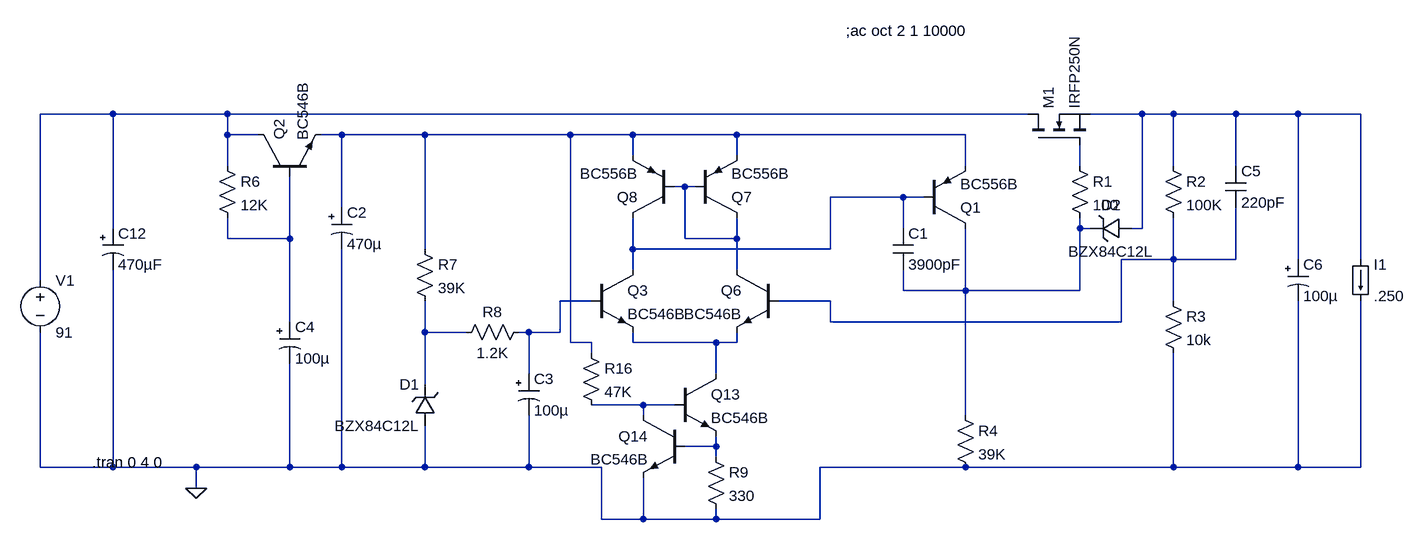
[diagram p0: schematic Sigma11.asc]
Sigma11.asc, the LTspice schematic file:
Version 4
SHEET 1 1752 1332
WIRE -272 112 -384 112
WIRE -96 112 -272 112
WIRE 1136 112 -96 112
WIRE 1312 112 1232 112
WIRE 1360 112 1312 112
WIRE 1456 112 1360 112
WIRE 1552 112 1456 112
WIRE 1648 112 1552 112
WIRE -96 144 -96 112
WIRE -48 144 -96 144
WIRE 80 144 48 144
WIRE 208 144 80 144
WIRE 432 144 208 144
WIRE 528 144 432 144
WIRE 688 144 528 144
WIRE 1040 144 688 144
WIRE 528 176 528 144
WIRE 688 176 688 144
WIRE -96 192 -96 144
WIRE 1040 192 1040 144
WIRE 1216 192 1216 160
WIRE 1360 192 1360 112
WIRE 1456 192 1456 112
WIRE 608 224 592 224
WIRE 624 224 608 224
WIRE 944 240 832 240
WIRE 976 240 944 240
WIRE 80 256 80 144
WIRE -272 288 -272 112
WIRE 944 288 944 240
WIRE 1216 288 1216 272
WIRE 1232 288 1216 288
WIRE 1312 288 1312 112
WIRE 1312 288 1296 288
WIRE -96 304 -96 272
WIRE 0 304 0 208
WIRE 0 304 -96 304
WIRE 608 304 608 224
WIRE 688 304 688 272
WIRE 688 304 608 304
WIRE 208 320 208 144
WIRE 528 320 528 272
WIRE 832 320 832 240
WIRE 832 320 528 320
WIRE 1360 336 1360 272
WIRE 1360 336 1280 336
WIRE 1456 336 1456 256
WIRE 1456 336 1360 336
WIRE 1552 336 1552 112
WIRE 1648 336 1648 112
WIRE 528 352 528 320
WIRE 688 352 688 304
WIRE -384 368 -384 112
WIRE 944 384 944 352
WIRE 1040 384 1040 288
WIRE 1040 384 944 384
WIRE 1216 384 1216 288
WIRE 1216 384 1040 384
WIRE 464 400 416 400
WIRE 832 400 752 400
WIRE 1360 400 1360 336
WIRE 0 432 0 304
WIRE 832 432 832 400
WIRE 1280 432 1280 336
WIRE 1280 432 832 432
WIRE 208 448 208 400
WIRE 272 448 208 448
WIRE 368 448 352 448
WIRE 416 448 416 400
WIRE 416 448 368 448
WIRE 432 464 432 144
WIRE 464 464 432 464
WIRE 528 464 528 448
WIRE 656 464 528 464
WIRE 688 464 688 448
WIRE 688 464 656 464
WIRE 464 480 464 464
WIRE 368 512 368 448
WIRE 656 512 656 464
WIRE 208 528 208 448
WIRE 544 560 464 560
WIRE 592 560 544 560
WIRE 544 576 544 560
WIRE 1040 576 1040 384
WIRE 656 624 656 608
WIRE 656 624 608 624
WIRE 656 640 656 624
WIRE -384 656 -384 448
WIRE -272 656 -272 352
WIRE -272 656 -384 656
WIRE -144 656 -272 656
WIRE 0 656 0 496
WIRE 0 656 -144 656
WIRE 80 656 80 320
WIRE 80 656 0 656
WIRE 208 656 208 592
WIRE 208 656 80 656
WIRE 368 656 368 576
WIRE 368 656 208 656
WIRE 480 656 368 656
WIRE 1040 656 816 656
WIRE 1360 656 1360 480
WIRE 1360 656 1040 656
WIRE 1552 656 1552 400
WIRE 1552 656 1360 656
WIRE 1648 656 1648 400
WIRE 1648 656 1552 656
WIRE -144 688 -144 656
WIRE 480 736 480 656
WIRE 544 736 544 672
WIRE 544 736 480 736
WIRE 656 736 656 720
WIRE 656 736 544 736
WIRE 816 736 816 656
WIRE 816 736 656 736
FLAG -144 688 0
SYMBOL polcap -16 432 R0
WINDOW 3 24 56 Left 2
SYMATTR Value 100µ
SYMATTR InstName C4
SYMATTR Description Capacitor
SYMATTR Type cap
SYMATTR SpiceLine V=6.3 Irms=2.9 Rser=0.018 Lser=0 mfg="KEMET" pn="A700D107M006ATE018" type="Al electrolytic"
SYMBOL nmos 1136 160 R270
SYMATTR InstName M1
SYMATTR Value IRFP250N
SYMBOL res 1200 176 R0
SYMATTR InstName R1
SYMATTR Value 100
SYMBOL res 1344 176 R0
SYMATTR InstName R2
SYMATTR Value 100K
SYMATTR SpiceLine tol=5
SYMBOL res 1344 384 R0
SYMATTR InstName R3
SYMATTR Value 10k
SYMATTR SpiceLine tol=5
SYMBOL pnp 976 288 M180
SYMATTR InstName Q1
SYMATTR Value BC556B
SYMBOL res 1024 560 R0
SYMATTR InstName R4
SYMATTR Value 39K
SYMBOL npn -48 208 R270
SYMATTR InstName Q2
SYMATTR Value BC546B
SYMBOL res -112 176 R0
SYMATTR InstName R6
SYMATTR Value 12K
SYMBOL polcap 64 256 R0
WINDOW 3 24 56 Left 2
SYMATTR Value 470µ
SYMATTR InstName C2
SYMATTR Description Capacitor
SYMATTR Type cap
SYMATTR SpiceLine V=6.3 Irms=2.9 Rser=0.018 Lser=0
SYMBOL res 192 304 R0
SYMATTR InstName R7
SYMATTR Value 39K
SYMBOL res 368 432 R90
WINDOW 0 0 56 VBottom 2
WINDOW 3 32 56 VTop 2
SYMATTR InstName R8
SYMATTR Value 1.2K
SYMBOL polcap 352 512 R0
WINDOW 3 24 56 Left 2
SYMATTR Value 100µ
SYMATTR InstName C3
SYMATTR Description Capacitor
SYMATTR Type cap
SYMATTR SpiceLine V=6.3 Irms=2.9 Rser=0.018 Lser=0 mfg="KEMET" pn="A700D107M006ATE018" type="Al electrolytic"
SYMBOL npn 464 352 R0
SYMATTR InstName Q3
SYMATTR Value BC546B
SYMBOL npn 752 352 M0
SYMATTR InstName Q6
SYMATTR Value BC546B
SYMBOL pnp 624 272 M180
SYMATTR InstName Q7
SYMATTR Value BC556B
SYMBOL pnp 592 272 R180
SYMATTR InstName Q8
SYMATTR Value BC556B
SYMBOL cap 928 288 R0
SYMATTR InstName C1
SYMATTR Value 3900pF
SYMATTR SpiceLine V=100 Irms=4.58 Rser=0.025 Lser=0
SYMBOL cap 1440 192 R0
SYMATTR InstName C5
SYMATTR Value 220pF
SYMATTR SpiceLine V=100 Irms=4.58 Rser=0.025 Lser=0
SYMBOL polcap 1536 336 R0
WINDOW 3 24 56 Left 2
SYMATTR Value 100µ
SYMATTR InstName C6
SYMATTR Description Capacitor
SYMATTR Type cap
SYMATTR SpiceLine V=6.3 Irms=2.9 Rser=0.018 Lser=0 mfg="KEMET" pn="A700D107M006ATE018" type="Al electrolytic"
SYMBOL zener 224 592 R180
WINDOW 0 24 64 Left 2
WINDOW 3 24 0 Left 2
SYMATTR InstName D1
SYMATTR Value BZX84C12L
SYMBOL polcap -288 288 R0
WINDOW 3 24 56 Left 2
SYMATTR Value 470µF
SYMATTR InstName C12
SYMATTR Description Capacitor
SYMATTR Type cap
SYMATTR SpiceLine V=10 Irms=2.07 Rser=0.028 Lser=0
SYMBOL voltage -384 352 R0
WINDOW 123 0 0 Left 2
WINDOW 39 0 0 Left 2
SYMATTR InstName V1
SYMATTR Value 91
SYMBOL npn 592 512 R0
SYMATTR InstName Q13
SYMATTR Value BC546B
SYMBOL npn 608 576 M0
SYMATTR InstName Q14
SYMATTR Value BC546B
SYMBOL res 640 624 R0
SYMATTR InstName R9
SYMATTR Value 330
SYMBOL res 448 464 R0
SYMATTR InstName R16
SYMATTR Value 47K
SYMBOL zener 1296 272 R90
WINDOW 0 -4 32 VBottom 2
WINDOW 3 36 32 VTop 2
SYMATTR InstName D2
SYMATTR Value BZX84C12L
SYMBOL load 1632 336 R0
WINDOW 123 0 0 Left 2
WINDOW 39 0 0 Left 2
SYMATTR InstName I1
SYMATTR Value .250
TEXT -304 648 Left 2 !.tran 0 4 0
TEXT 856 -16 Left 2 !;ac oct 2 1 10000

The netlist it stands for:
* Sigma11.asc
C4 N008 0 100µ V=6.3 Irms=2.9 Rser=0.018 Lser=0 mfg="KEMET" pn="A700D107M006ATE018" type="Al electrolytic"
M1 N001 N004 N002 N002 IRFP250N
R1 N004 N007 100
R2 N002 N009 100K tol=5
R3 N009 0 10k tol=5
Q1 N007 N006 N003 0 BC556B
R4 N007 0 39K
Q2 N001 N008 N003 0 BC546B
R6 N001 N008 12K
C2 N003 0 470µ V=6.3 Irms=2.9 Rser=0.018 Lser=0
R7 N003 N011 39K
R8 N010 N011 1.2K
C3 N010 0 100µ V=6.3 Irms=2.9 Rser=0.018 Lser=0 mfg="KEMET" pn="A700D107M006ATE018" type="Al electrolytic"
Q3 N006 N010 N012 0 BC546B
Q6 N005 N009 N012 0 BC546B
Q7 N005 N005 N003 0 BC556B
Q8 N006 N005 N003 0 BC556B
C1 N006 N007 3900pF V=100 Irms=4.58 Rser=0.025 Lser=0
C5 N002 N009 220pF V=100 Irms=4.58 Rser=0.025 Lser=0
C6 N002 0 100µ V=6.3 Irms=2.9 Rser=0.018 Lser=0 mfg="KEMET" pn="A700D107M006ATE018" type="Al electrolytic"
D1 0 N011 BZX84C12L
C12 N001 0 470µF V=10 Irms=2.07 Rser=0.028 Lser=0
V1 N001 0 91
Q13 N012 N013 N014 0 BC546B
Q14 N013 N014 0 0 BC546B
R9 N014 0 330
R16 N003 N013 47K
D2 N002 N007 BZX84C12L
I1 N002 0 .250
.model D D
.lib standard.dio
.model NPN NPN
.model PNP PNP
.lib standard.bjt
.model NMOS NMOS
.model PMOS PMOS
.lib standard.mos
.tran 0 4 0
;ac oct 2 1 10000
.backanno
.end